# Altium schematic sheet LedChannel.SchDoc: LED Channel
size A4; DocumentNumber: 3; SheetNumber: 3; SheetTotal: 3
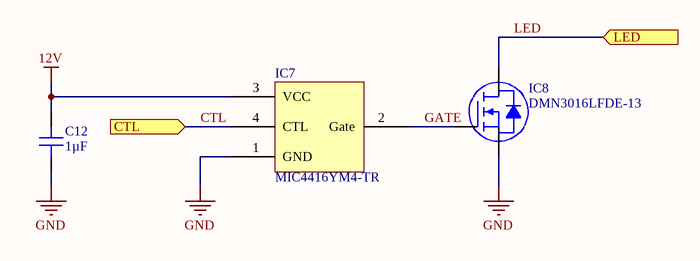
[diagram p0: LedChannel.SchDoc]

## Parts
C12  1µF  [CAP 0603_1608]
IC7  MIC4416YM4-TR  [MICROCHIP SOT-143-4]
IC8  DMN3016LFDE-13  [DIODES U-DFN2020-6E]

## Ports
CTL (in), LED (in)

## Nets
12V: C12.2 IC7.3(VCC)
GND: C12.1 IC7.1(GND) IC8.S
CTL: IC7.4(CTL) ; port CTL
GATE: IC7.2(Gate) IC8.G
LED: IC8.D(Drain) ; port LED

## Notes on the sheet
- Title
- Size:
- Date:
- A4
- Number:
- Time:
- Revision:
- Sheet
- of
- File:

## Library data of the parts
C12 = CL10A105KA8NFNC: CAP CER 1UF 25V X5R 0603; Manufacturer: Samsung Electro-Mechanics; Tolerance: ±10%; Part Number: CL10A105KA8NFNC; Value: 1µF; Applications: General Purpose; Capacitance: 1µF; ComponentLink1Description: Datasheet; ComponentLink1URL: http://www.samsungsem.com/kr/support/product-search/mlcc/CL10A105KA8NFNC.jsp; ComponentLink2Description: DigiKey Link; ComponentLink2URL: http://digikey.com/product-detail/en/samsung-electro-mechanics/CL10A105KA8NFNC/1276-1859-1-ND/3889945; Device Package: 0603 (1608 Metric); LastUpdated: 21/01/2020 00:01:49; Lifecycle Status: Active; Minimum Order: 1; Mounting Type: Surface Mount, MLCC; Operating Temperature: -55°C ~ 85°C; Package / Case: 0603 (1608 Metric); Packaging: TapeAndReel; PartId: 14268; Part Status: Active; Price: 0.01; Series: CL; Size / Dimension: 0.063" L x 0.031" W (1.60mm x 0.80mm); Supplier 1: DigiKey; Supplier Part Number 1: 1276-1859-1-ND; Temperature Coefficient: X5R; Thickness (Max): 0.035" (0.90mm); Voltage - Rated: 25V
IC7 = MIC4416YM4-TR: IC GATE DRVR LOW-SIDE SOT143; Manufacturer: Microchip Technology; Channel Type: Single; Current - Peak Output (Source, Sink): 1.2A, 1.2A; Gate Type: N-Channel MOSFET; Input Type: Non-Inverting; Logic Voltage - VIL, VIH: 0.8V, 2.4V; Number of Drivers: 1; Rise / Fall Time (Typ): 14ns, 16ns; Voltage - Supply: 4.5V ~ 18V; Part Number: MIC4416YM4-TR; ComponentLink1Description: Datasheet; ComponentLink1URL: http://www.microchip.com/mymicrochip/filehandler.aspx?ddocname=en579163; ComponentLink2Description: DigiKey Link; ComponentLink2URL: http://digikey.com/product-detail/en/microchip-technology/MIC4416YM4-TR/576-1187-1-ND/771864; Device Package: TO-253-4, TO-253AA; Driven Configuration: Low-Side; LastUpdated: 31/01/2020 01:32:45; Lifecycle Status: Active; Minimum Order: 1; Mounting Type: Surface Mount; Operating Temperature: -40°C ~ 150°C (TJ); Package / Case: TO-253-4, TO-253AA; Packaging: TapeAndReel; PartId: 7; Part Status: Active; Price: 0.68; Series: IttyBitty®; Supplier 1: DigiKey; Supplier Part Number 1: 576-1187-1-ND; Supplier Device Package: SOT-143
IC8 = DMN3016LFDE-13: MOSFET N-CH 30V U-DFN2020-6; Manufacturer: Diodes Incorporated; Current - Continuous Drain (Id) @ 25°C: 10A (Ta); Drive Voltage (Max Rds On,  Min Rds On): 4.5V, 10V; FET Type: N-Channel; Gate Charge (Qg) (Max) @ Vgs: 25.1nC @ 10V; Input Capacitance (Ciss) (Max) @ Vds: 1415pF @ 15V; Power Dissipation (Max): 730mW (Ta); Rds On (Max) @ Id, Vgs: 12mOhm @ 11A, 10V; Vgs (Max): ±20V; Vgs(th) (Max) @ Id: 2V @ 250µA; Part Number: DMN3016LFDE-13; ComponentLink1Description: Datasheet; ComponentLink1URL: https://www.diodes.com/assets/Datasheets/DMN3016LFDE.pdf; ComponentLink2Description: DigiKey Link; ComponentLink2URL: http://digikey.com/product-detail/en/diodes-incorporated/DMN3016LFDE-13/DMN3016LFDE-13DICT-ND/8545930; Device Package: 6-UDFN Exposed Pad; Drain to Source Voltage (Vdss): 30V; LastUpdated: 30/03/2020 13:01:59; Lifecycle Status: Active; Minimum Order: 1; Mounting Type: Surface Mount; Operating Temperature: -55°C ~ 150°C (TJ); Package / Case: 6-UDFN Exposed Pad; Packaging: TapeAndReel; Part Status: Active; Price: 0.10; Series: -; Supplier 1: DigiKey; Supplier Part Number 1: DMN3016LFDE-13DICT-ND; Supplier Device Package: U-DFN2020-6 (Type E); Technology: MOSFET (Metal Oxide)